# EAGLE schematic servo_controller_1.2 (EAGLE 7.3.0)
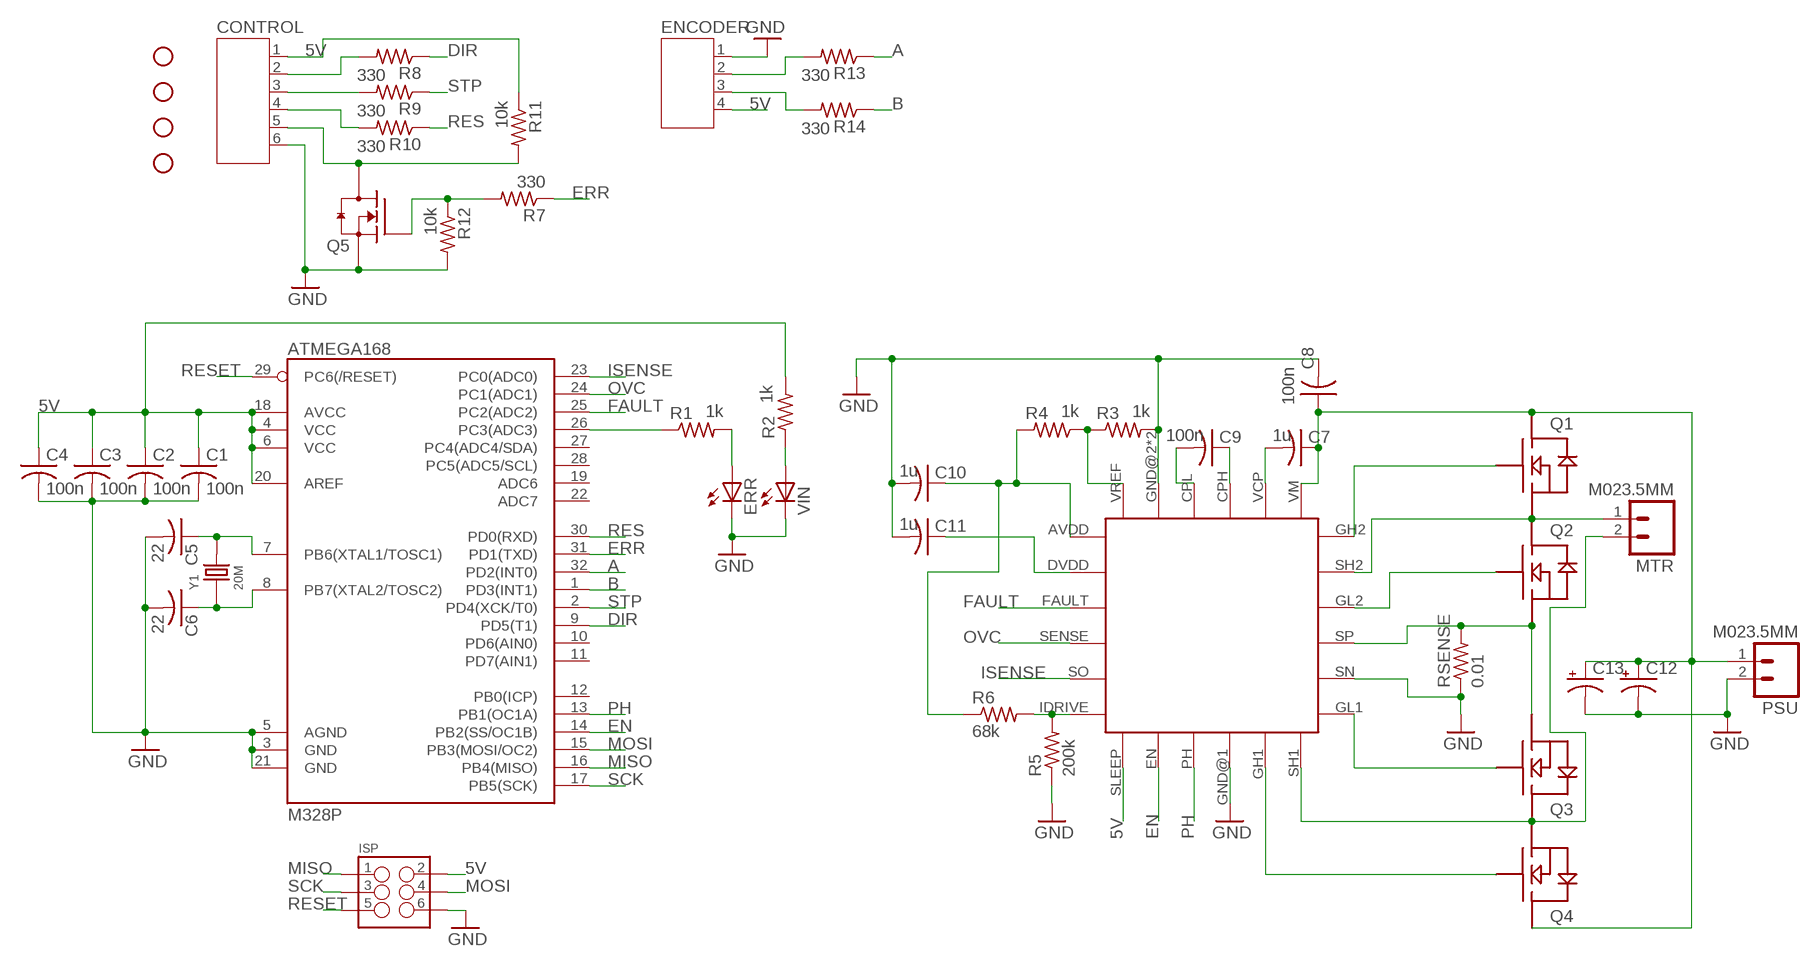
[diagram p0: schematic, sheet 1]

## Parts
8701  DRV8701  [VQFN24]
C1  100n  C-USC0603  [C0603]
C2  100n  C-USC0603  [C0603]
C3  100n  C-USC0603  [C0603]
C4  100n  C-USC0603  [C0603]
C5  22  C-USC0603  [C0603]
C6  22  C-USC0603  [C0603]
C7  1u  C-USC0603  [C0603]
C8  100n  C-USC0603  [C0603]
C9  100n  C-USC0603  [C0603]
C10  1u  C-USC0603  [C0603]
C11  1u  C-USC0603  [C0603]
C12  CPOL-USE5-8.5  [E5-8,5]
C13  CPOL-USE5-8.5  [E5-8,5]
CONTROL  JST-PH6  [JST-PH6]
ENCODER  JST-PH4  [JST-PH4]
ERR  LEDCHIP-LED0603  [CHIP-LED0603]
ISP  M03X22X3_SILK_SM  [2X3]
M328P  ATMEGA168  [TQFP32-08]
MTR  M023.5MM  [SCREWTERMINAL-3.5MM-2]
PSU  M023.5MM  [SCREWTERMINAL-3.5MM-2]
Q1  NEXFET_SINGLECSD18537NQ5A  [SON5X6]
Q2  NEXFET_SINGLECSD18537NQ5A  [SON5X6]
Q3  NEXFET_SINGLECSD18537NQ5A  [SON5X6]
Q4  NEXFET_SINGLECSD18537NQ5A  [SON5X6]
Q5  MOSFET-NCH_SOT-23  [SOT95P280X135-3N]
R1  1k  R-US_R0603  [R0603]
R2  1k  R-US_R0603  [R0603]
R3  1k  R-US_R0603  [R0603]
R4  1k  R-US_R0603  [R0603]
R5  200k  R-US_R0603  [R0603]
R6  68k  R-US_R0603  [R0603]
R7  330  R-US_R0603  [R0603]
R8  330  R-US_R0603  [R0603]
R9  330  R-US_R0603  [R0603]
R10  330  R-US_R0603  [R0603]
R11  10k  R-US_R0603  [R0603]
R12  10k  R-US_R0603  [R0603]
R13  330  R-US_R0603  [R0603]
R14  330  R-US_R0603  [R0603]
RSENSE  0.01  R-US_R2512  [R2512]
STANDOFF1  STAND-OFF  [STAND-OFF]
STANDOFF2  STAND-OFF  [STAND-OFF]
STANDOFF3  STAND-OFF  [STAND-OFF]
STANDOFF4  STAND-OFF  [STAND-OFF]
VIN  LEDCHIP-LED0603  [CHIP-LED0603]
Y1  20M  SMD-CRYSTAL-16MHZ-8PF-20PPM-40R(2P-5.0X3.2MM)  [X2-SMD-5.0X3.2X1.3MM]

## Nets
5V: 8701.SLEEP C1.1 C2.1 C3.1 C4.1 CONTROL.1 ENCODER.4 ISP.2 M328P.4(VCC) M328P.6(VCC) M328P.18(AVCC) M328P.20(AREF) R2.2 R11.1
A: M328P.32(PD2(INT0)) R13.1
B: M328P.1(PD3(INT1)) R14.1
DIR: M328P.9(PD5(T1)) R8.1
EN: 8701.EN M328P.14(PB2(SS/OC1B))
ERR: M328P.31(PD1(TXD)) R7.1
FAULT: 8701.FAULT M328P.25(PC2(ADC2))
GND: 8701.GND@1(GND) 8701.GND@2(GND) 8701.GND@3(GND) 8701.SN C1.2 C2.2 C3.2 C4.2 C5.2 C6.2 C8.2 C10.2 C11.2 C12.- C13.- CONTROL.6 ENCODER.1 ERR.C ISP.6 M328P.3(GND) M328P.5(AGND) M328P.21(GND) PSU.2 Q5.2(S) R3.2 R5.1 R12.2 RSENSE.1 VIN.C
ISENSE: 8701.SO M328P.23(PC0(ADC0))
MISO: ISP.1 M328P.16(PB4(MISO))
MOSI: ISP.4 M328P.15(PB3(MOSI/OC2))
N$1: 8701.GL1 Q3.GATE
N$2: 8701.SH1 MTR.2 Q3.DRAIN@1(DRAIN) Q3.DRAIN@2(DRAIN) Q3.DRAIN@3(DRAIN) Q3.DRAIN@4(DRAIN) Q3.DRAIN@5(DRAIN) Q4.SOURCE@1(SOURCE) Q4.SOURCE@2(SOURCE) Q4.SOURCE@3(SOURCE)
N$3: 8701.SH2 MTR.1 Q1.SOURCE@1(SOURCE) Q1.SOURCE@2(SOURCE) Q1.SOURCE@3(SOURCE) Q2.DRAIN@1(DRAIN) Q2.DRAIN@2(DRAIN) Q2.DRAIN@3(DRAIN) Q2.DRAIN@4(DRAIN) Q2.DRAIN@5(DRAIN)
N$4: 8701.GH2 Q1.GATE
N$5: 8701.SP Q2.SOURCE@1(SOURCE) Q2.SOURCE@2(SOURCE) Q2.SOURCE@3(SOURCE) Q3.SOURCE@1(SOURCE) Q3.SOURCE@2(SOURCE) Q3.SOURCE@3(SOURCE) RSENSE.2
N$6: 8701.GL2 Q2.GATE
N$7: 8701.GH1 Q4.GATE
N$8: R2.1 VIN.A
N$9: C5.1 M328P.7(PB6(XTAL1/TOSC1)) Y1.2
N$10: ENCODER.2 R13.2
N$11: 8701.VCP C7.2
N$12: 8701.CPL C9.2
N$13: 8701.CPH C9.1
N$14: ENCODER.3 R14.2
N$15: 8701.VREF R3.1 R4.1
N$16: 8701.AVDD C10.1 R4.2 R6.1
N$17: 8701.DVDD C11.1
N$18: C6.1 M328P.8(PB7(XTAL2/TOSC2)) Y1.1
N$19: ERR.A R1.2
N$20: Q5.1(G) R7.2 R12.1
N$21: 8701.IDRIVE R5.2 R6.2
N$23: 8701.VM C7.1 C8.1 C12.+ C13.+ PSU.1 Q1.DRAIN@1(DRAIN) Q1.DRAIN@2(DRAIN) Q1.DRAIN@3(DRAIN) Q1.DRAIN@4(DRAIN) Q1.DRAIN@5(DRAIN) Q4.DRAIN@1(DRAIN) Q4.DRAIN@2(DRAIN) Q4.DRAIN@3(DRAIN) Q4.DRAIN@4(DRAIN) Q4.DRAIN@5(DRAIN)
N$24: M328P.26(PC3(ADC3)) R1.1
N$31: CONTROL.2 R8.2
N$32: CONTROL.3 R9.2
N$33: CONTROL.4 R10.2
N$34: CONTROL.5 Q5.3(D) R11.2
OVC: 8701.SENSE M328P.24(PC1(ADC1))
PH: 8701.PH M328P.13(PB1(OC1A))
RES: M328P.30(PD0(RXD)) R10.1
RESET: ISP.5 M328P.29(PC6(/RESET))
SCK: ISP.3 M328P.17(PB5(SCK))
STP: M328P.2(PD4(XCK/T0)) R9.1
Unconnected: M328P.10(PD6(AIN0)) M328P.11(PD7(AIN1)) M328P.12(PB0(ICP)) M328P.19(ADC6) M328P.22(ADC7) M328P.27(PC4(ADC4/SDA)) M328P.28(PC5(ADC5/SCL))

## Library data of the parts
8701 = drv8x:DRV8701
C1-C11 = adafruit:C-US: CAPACITOR, American symbol
C12 C13 = adafruit:CPOL-US: POLARIZED CAPACITOR, American symbol
CONTROL = jst-ph:JST-PH6
ENCODER = jst-ph:JST-PH4
ERR VIN = adafruit:LED: LED OSRAM: - CHIPLED LG R971, LG N971, LY N971, LG Q971, LY Q971, LO R971, LY R971 LH N974, LH R974 LS Q976, LO Q976, LY Q976 LO Q996 - Hyper CHIPLED LW Q18S LB Q993, LB Q99A, LB R99A - SideLED LS A670, LO A670, LY A670, LG A670, LP A670 LB A673, LV A673, LT A673, LW A673 LH A674 LY A675 LS A676, LA A676, LO A676, LY A676, LW A676 LS A679, LY A679, LG A679 - Hyper Micro SIDELED® LS Y876, LA Y876, LO Y876, LY Y876 LT Y87S - SmartLED LW L88C, LW L88S LB L89C, LB L89S, LG L890 LS L89K, LO L89K, LY L89K LS L896, LA L896, LO L896, LY L896 - TOPLED LS T670, LO T670, LY T670, LG T670, LP T670 LSG T670, LSP T670, LSY T670, LOP T670, LYG T670 LG T671, LOG T671, LSG T671 LB T673, LV T673, LT T673, LW T673 LH T674 LS T676, LA T676, LO T676, LY T676, LB T676, LH T676, LSB T676, LW T676 LB T67C, LV T67C, LT T67C, LS T67K, LO T67K, LY T67K, LW E67C LS E67B, LA E67B, LO E67B, LY E67B, LB E67C, LV E67C, LT E67C LW T67C LS T679, LY T679, LG T679 LS T770, LO T770, LY T770, LG T770, LP T770 LB T773, LV T773, LT T773, LW T773 LH T774 LS E675, LA E675, LY E675, LS T675 LS T776, LA T776, LO T776, LY T776, LB T776 LHGB T686 LT T68C, LB T68C - Hyper Mini TOPLED® LB M676 - Mini TOPLED Santana® LG M470 LS M47K, LO M47K, LY M47K Source: http://www.osram.convergy.de/
ISP = SparkFun-Connectors:M03X2: 2x3 .1" header. Shrouded, with keying- CONN-10681 SMT- CONN-11415 Pogo pins- HW-11044
M328P = SparkFun-DigitalIC:ATMEGA168: Atmel 32-pin 8-bit micro, 16k flash.
MTR PSU = SparkFun-Connectors:M02: Standard 2-pin 0.1" header. Use with - straight break away headers ( PRT-00116) - right angle break away headers (PRT-00553) - swiss pins (PRT-00743) - machine pins (PRT-00117) - female headers (PRT-00115) Molex polarized connector foot print use with: PRT-08233 with associated crimp pins and housings. 2.54_SCREWTERM for use with PRT-10571. 3.5mm Screw Terminal footprints for PRT-08084 5mm Screw Terminal footprints for use with PRT-08432
Q1-Q4 = mosfet:NEXFET_SINGLE
Q5 = ipc-7351-transistor:MOSFET-NCH_
R1-R14 RSENSE = adafruit:R-US_: RESISTOR, American symbol
STANDOFF1-STANDOFF4 = SparkFun-Electromechanical:STAND-OFF: #4 Stand Off This is the mechanical footprint for a #4 phillips button head screw. Use the keepout ring to avoid running the screw head into surrounding components. SKU : PRT-00447
Y1 = OPL-crystal-osctllator:SMD-CRYSTAL-16MHZ-8PF-20PPM-40R(2P-5.0X3.2MM): 306010054; MPN: X053201602002